# EAGLE design placa2caras_v4 (EAGLE 7.4.0)
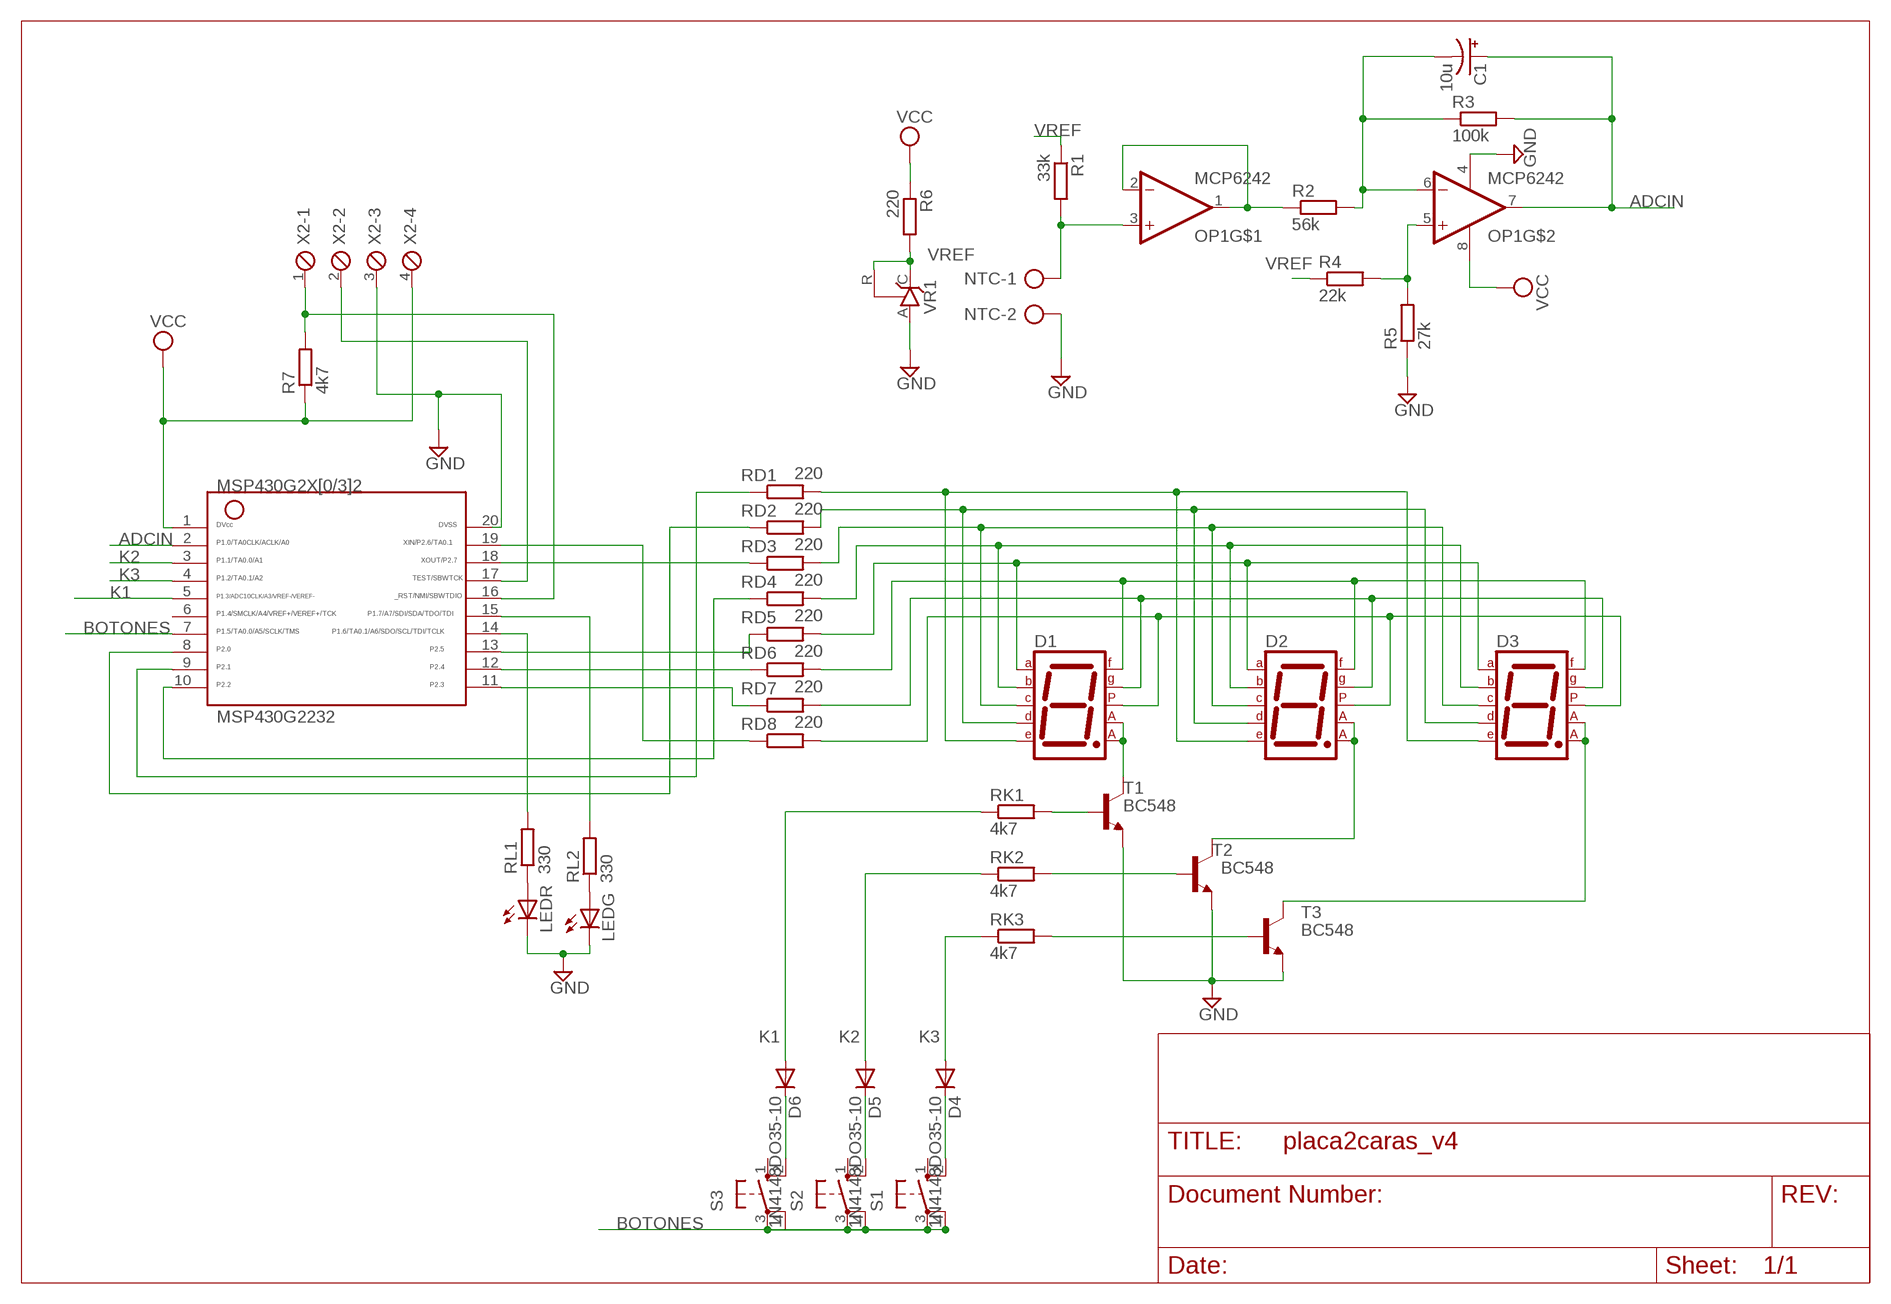
[diagram p0: schematic, sheet 1]

## Parts
C1  10u  CPOL-USE2,5-6E  [E2,5-6E]
D1  7SEG-CA  [7SEG-13]
D2  7SEG-CA  [7SEG-13]
D3  7SEG-CA  [7SEG-13]
D4  1N4148DO35-10  [DO35-10]
D5  1N4148DO35-10  [DO35-10]
D6  1N4148DO35-10  [DO35-10]
LEDG  LED5MM  [LED5MM]
LEDR  LED5MM  [LED5MM]
MSP430G2232  G2X[0/3]2---N20  [N20]
NTC  AK500/2  [AK500/2]
OP1  MCP6242  MCP6242CONPADGORDO  [DIL8_MOD]
R1  33k  R-EU_0207/10  [0207/10]
R2  56k  R-EU_0207/10  [0207/10]
R3  100k  R-EU_0207/10  [0207/10]
R4  22k  R-EU_0207/10  [0207/10]
R5  27k  R-EU_0207/10  [0207/10]
R6  220  R-EU_0207/10  [0207/10]
R7  4k7  R-EU_0207/10  [0207/10]
RD1  220  R-EU_0207/10  [0207/10]
RD2  220  R-EU_0207/10  [0207/10]
RD3  220  R-EU_0207/10  [0207/10]
RD4  220  R-EU_0207/10  [0207/10]
RD5  220  R-EU_0207/10  [0207/10]
RD6  220  R-EU_0207/10  [0207/10]
RD7  220  R-EU_0207/10  [0207/10]
RD8  220  R-EU_0207/10  [0207/10]
RK1  4k7  R-EU_0207/10  [0207/10]
RK2  4k7  R-EU_0207/10  [0207/10]
RK3  4k7  R-EU_0207/10  [0207/10]
RL1  330  R-EU_0207/10  [0207/10]
RL2  330  R-EU_0207/10  [0207/10]
S1  10-XX  [B3F-10XX]
S2  10-XX  [B3F-10XX]
S3  10-XX  [B3F-10XX]
T1  BC548  [TO92-EBC]
T2  BC548  [TO92-EBC]
T3  BC548  [TO92-EBC]
VR1  TL431CLP  [TO92-CLP]
X2  MPT4  [4POL254]

## Nets
ADCIN: C1.+ MSP430G2232.2 OP1.7(OUT) R3.2
BOTONES: MSP430G2232.7 S1.3(P) S1.4(P1) S2.3(P) S2.4(P1) S3.3(P) S3.4(P1)
GND: LEDG.K(C) LEDR.K(C) MSP430G2232.20 NTC.2 OP1.4(V-) R5.1 T1.E T2.E T3.E VR1.A X2.3
K1: D6.A MSP430G2232.5 RK1.1
K2: D5.A MSP430G2232.3 RK2.1
K3: D4.A MSP430G2232.4 RK3.1
N$1: RK1.2 T1.B
N$2: RK2.2 T2.B
N$3: RK3.2 T3.B
N$4: D1.7(A) D2.7(A) D3.7(A) RD5.2
N$5: D1.3(CA1) D1.8(CA2) T1.C
N$6: D1.6(B) D2.6(B) D3.6(B) RD4.2
N$7: D2.3(CA1) D2.8(CA2) T2.C
N$8: D1.4(C) D2.4(C) D3.4(C) RD3.2
N$9: D3.3(CA1) D3.8(CA2) T3.C
N$10: D1.2(D) D2.2(D) D3.2(D) RD2.2
N$11: MSP430G2232.17 X2.2
N$12: D1.1(E) D2.1(E) D3.1(E) RD1.2
N$13: OP1.5(+IN) R4.2 R5.2
N$14: D1.9(F) D2.9(F) D3.9(F) RD6.2
N$15: NTC.1 OP1.3(+IN) R1.2
N$16: D1.10(G) D2.10(G) D3.10(G) RD7.2
N$17: OP1.1(OUT) OP1.2(-IN) R2.1
N$18: D1.5(DP) D2.5(DP) D3.5(DP) RD8.2
N$19: C1.- OP1.6(-IN) R2.2 R3.1
N$20: MSP430G2232.16 R7.2 X2.1
N$21: MSP430G2232.19 RD8.1
N$22: MSP430G2232.18 RD3.1
N$23: MSP430G2232.13 RD5.1
N$24: MSP430G2232.12 RD6.1
N$25: MSP430G2232.11 RD7.1
N$26: MSP430G2232.10 RD4.1
N$27: MSP430G2232.9 RD1.1
N$28: MSP430G2232.8 RD2.1
N$29: D5.C S2.2(S1)
N$30: D4.C S1.2(S1)
N$31: D6.C S3.2(S1)
N$32: MSP430G2232.15 RL2.2
N$33: LEDR.A RL1.1
N$34: MSP430G2232.14 RL1.2
N$35: LEDG.A RL2.1
VCC: MSP430G2232.1 OP1.8(V+) R6.1 R7.1 X2.4
VREF: R1.1 R4.1 R6.2 VR1.C VR1.R
Unconnected: MSP430G2232.6 S1.1(S) S2.1(S) S3.1(S)

## Library data of the parts
C1 = rcl:CPOL-US: POLARIZED CAPACITOR, American symbol
D1-D3 = special:7SEG-CA: 7-segment DISPLAY single anode, 13 mm
D4-D6 = diode:1N4148: DIODE high speed (Philips)
LEDG LEDR = led:LED: LED OSRAM: - CHIPLED LG R971, LG N971, LY N971, LG Q971, LY Q971, LO R971, LY R971 LH N974, LH R974 LS Q976, LO Q976, LY Q976 LO Q996 - Hyper CHIPLED LW Q18S LB Q993, LB Q99A, LB R99A - SideLED LS A670, LO A670, LY A670, LG A670, LP A670 LB A673, LV A673, LT A673, LW A673 LH A674 LY A675 LS A676, LA A676, LO A676, LY A676, LW A676 LS A679, LY A679, LG A679 - Hyper Micro SIDELED® LS Y876, LA Y876, LO Y876, LY Y876 LT Y87S - SmartLED LW L88C, LW L88S LB L89C, LB L89S, LG L890 LS L89K, LO L89K, LY L89K LS L896, LA L896, LO L896, LY L896 - TOPLED LS T670, LO T670, LY T670, LG T670, LP T670 LSG T670, LSP T670, LSY T670, LOP T670, LYG T670 LG T671, LOG T671, LSG T671 LB T673, LV T673, LT T673, LW T673 LH T674 LS T676, LA T676, LO T676, LY T676, LB T676, LH T676, LSB T676, LW T676 LB T67C, LV T67C, LT T67C, LS T67K, LO T67K, LY T67K, LW E67C LS E67B, LA E67B, LO E67B, LY E67B, LB E67C, LV E67C, LT E67C LW T67C LS T679, LY T679, LG T679 LS T770, LO T770, LY T770, LG T770, LP T770 LB T773, LV T773, LT T773, LW T773 LH T774 LS E675, LA E675, LY E675, LS T675 LS T776, LA T776, LO T776, LY T776, LB T776 LHGB T686 LT T68C, LB T68C - Hyper Mini TOPLED® LB M676 - Mini TOPLED Santana® LG M470 LS M47K, LO M47K, LY M47K Source: http://www.osram.convergy.de LUXEON: - LUMILED® LXK2-PW12-R00, LXK2-PW12-S00, LXK2-PW14-U00, LXK2-PW14-V00 LXK2-PM12-R00, LXK2-PM12-S00, LXK2-PM14-U00 LXK2-PE12-Q00, LXK2-PE12-R00, LXK2-PE12-S00, LXK2-PE14-T00, LXK2-PE14-U00 LXK2-PB12-K00, LXK2-PB12-L00, LXK2-PB12-M00, LXK2-PB14-N00, LXK2-PB14-P00, LXK2-PB14-Q00 LXK2-PR12-L00, LXK2-PR12-M00, LXK2-PR14-Q00, LXK2-PR14-R00 LXK2-PD12-Q00, LXK2-PD12-R00, LXK2-PD12-S00 LXK2-PH12-R00, LXK2-PH12-S00 LXK2-PL12-P00, LXK2-PL12-Q00, LXK2-PL12-R00 Source: www.luxeon.com KINGBRIGHT: KA-3528ASYC Source: www.kingbright.com
MSP430G2232 = TI_MSP430_v16:G2X[0/3]2---N20: MSP430G2X[0/3]2 MSP430G2x32, MSP430G2x02 PDIP (N) 20 Pin Package http://focus.ti.com/docs/prod/folders/print/msp430g2432.html
NTC = con-ptr500:AK500/2: CONNECTOR; OC_FARNELL: unknown; OC_NEWARK: unknown
OP1 = linear:MCP6242: Opamp de Microchip. Rail to rail, 3V
R1-R7 RD1-RD8 RK1-RK3 RL1 RL2 = resistor:R-EU_: RESISTOR, European symbol
S1-S3 = switch-omron:10-XX: OMRON SWITCH; MPN: B3F-1000; OC_FARNELL: 176432; OC_NEWARK: 36M3542
T1-T3 = transistor-npn:BC548*: NPN Transistor
VR1 = v-reg:TL431CLP: VOLTAGE REGULATOR
X2 = con-phoenix-254:MPT4: PHOENIX CONNECTOR; OC_FARNELL: unknown; OC_NEWARK: unknown

## Board
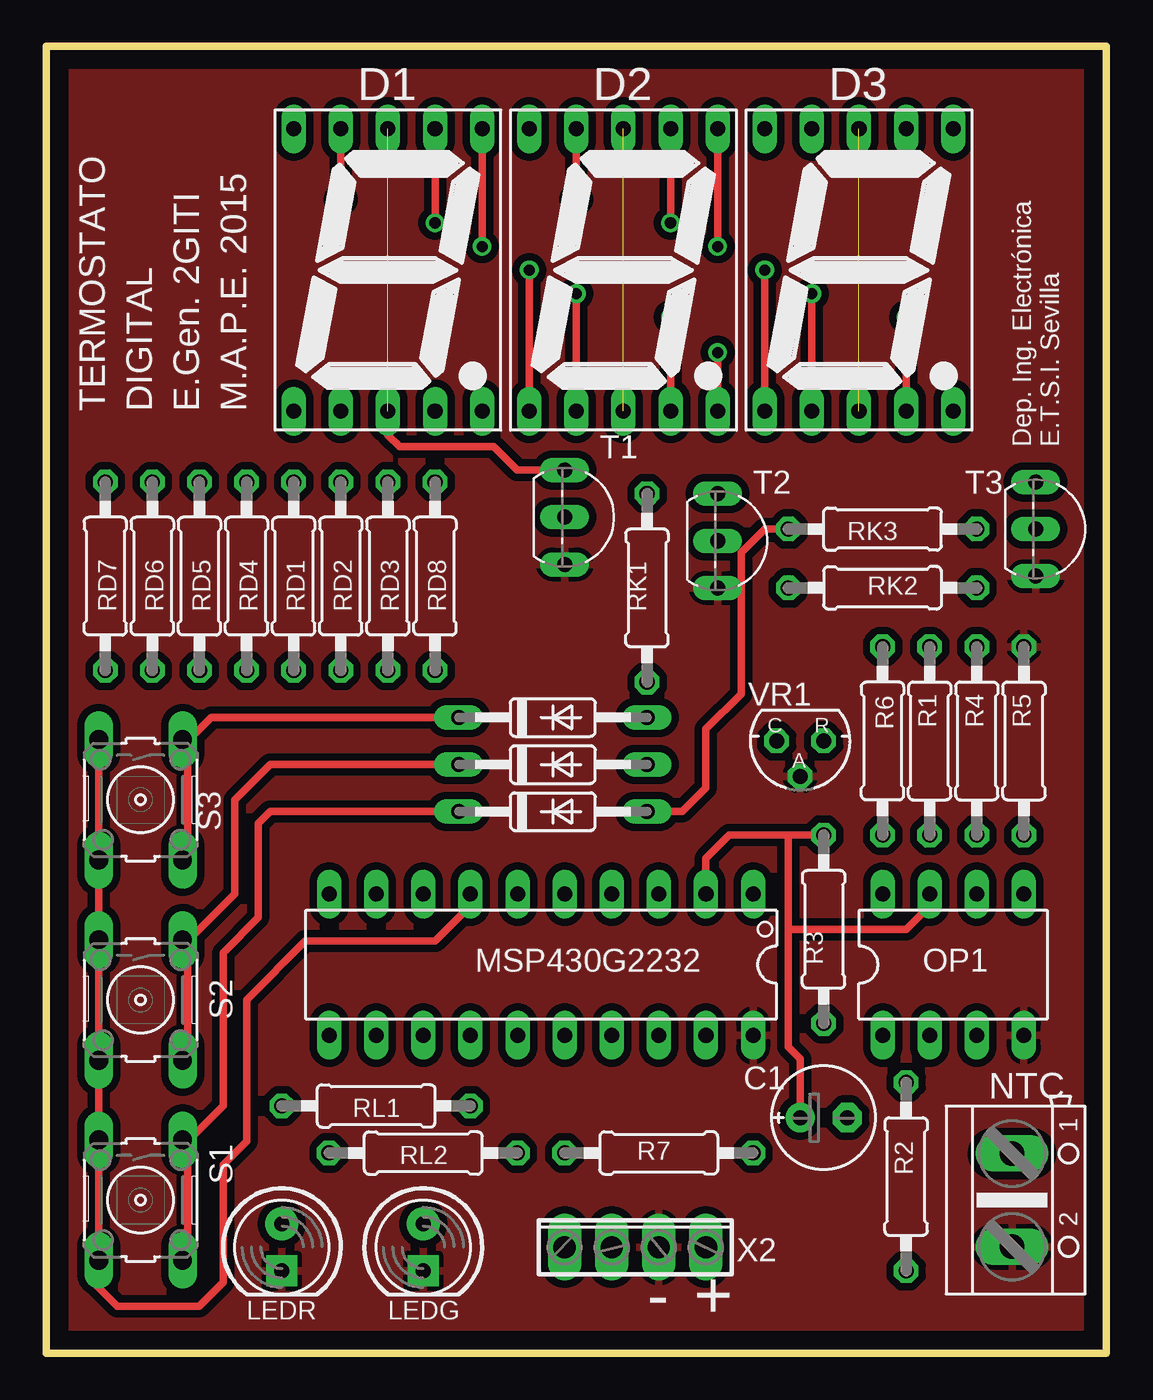
[diagram p1: board, top side]
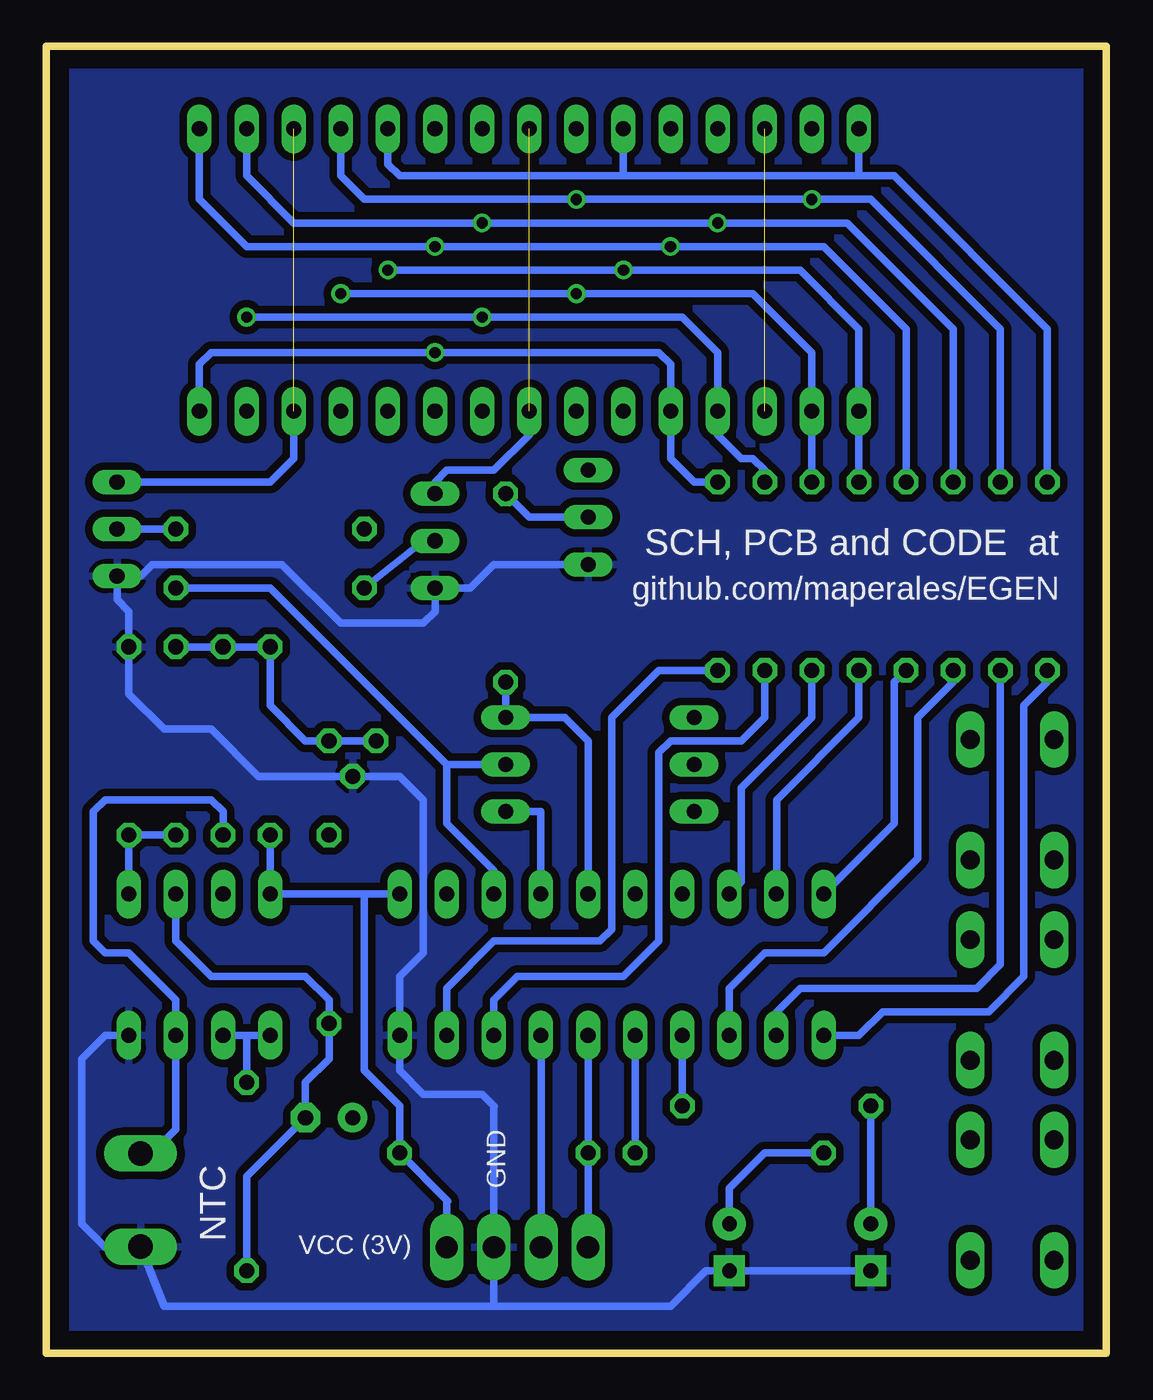
[diagram p2: board, bottom side, seen from below]

Size 57.15 x 70.48 mm. Coordinates in mm from the lower left corner, seen from the top.
Outline: 0,70.48 57.15,70.48 57.15,0 0,0 0,70.48
Copper layers (1*16): Top 0.035mm / dielectric 1.5mm / Bottom 0.035mm
Design rules "default *": minimum track width 10mil, minimum drill 23mil, track to track 8mil, track to pad 8mil, pad to pad 8mil, via to via 8mil, smd to smd 8mil, copper to edge 40mil, drill to drill 8mil, minimum pad ring 10mil, minimum via ring 8mil, stop-mask expansion 4mil, vias tented up to drill 0mil, thermal gap 10mil

### Footprints (pad centres in the part's own frame; a part is rotated, then mirrored left to right if it is on the bottom)
E2,5-6E = drill 0.813 pad 1.575: + -1.27,0 | drill 0.813 pad 1.575 octagon: - 1.27,0
7SEG-13 = drill 0.813 long: 1 -5.08,-7.62; 2 -2.54,-7.62; 3 0,-7.62; 4 2.54,-7.62; 5 5.08,-7.62; 6 5.08,7.62; 7 2.54,7.62; 8 0,7.62; 9 -2.54,7.62; 10 -5.08,7.62
DO35-10 = drill 0.813 long: A 5.08,0; C -5.08,0
LED5MM = drill 0.8 pad 1.778: A -1.27,0 | drill 0.8 pad 1.676 square: K 1.27,0
N20 = drill 0.813 long: 1 -11.435,-3.81; 2 -8.895,-3.81; 3 -6.355,-3.81; 4 -3.815,-3.81; 5 -1.275,-3.81; 6 1.265,-3.81; 7 3.805,-3.81; 8 6.345,-3.81; 9 8.885,-3.81; 10 11.425,-3.81; 11 11.425,3.81; 12 8.885,3.81; 13 6.345,3.81; 14 3.805,3.81; 15 1.265,3.81; 16 -1.275,3.81; 17 -3.815,3.81; 18 -6.355,3.81; 19 -8.895,3.81; 20 -11.435,3.81
AK500/2 = drill 1.321 long: 1 -2.515,0; 2 2.515,0
DIL8_MOD = drill 0.813 pad 1.27 long: 1 -6.35,-3.81; 2 -3.81,-3.81; 3 -1.27,-3.81; 4 1.27,-3.81; 5 1.27,3.81; 6 -1.27,3.81; 7 -3.81,3.81; 8 -6.35,3.81
0207/10 = drill 0.813 octagon: 1 -5.08,0; 2 5.08,0
B3F-10XX = drill 1.016 long: 1 -3.251,2.261; 2 3.251,2.261; 3 -3.251,-2.261; 4 3.251,-2.261
TO92-EBC = drill 0.813 long: B 0,-1.27; C -2.54,-1.27; E 2.54,-1.27
TO92-CLP = drill 0.813 octagon: A 0,1.905; C 1.27,0; R -1.27,0
4POL254 = drill 1.2 long: 1 -3.81,0; 2 -1.27,0; 3 1.27,0; 4 3.81,0

### Placement (x,y rotation side)
C1  41.91,12.7 0 top
D1  18.41,58.42 0 top
D2  31.12,58.42 0 top
D3  43.81,58.42 0 top
D4  27.3,29.21 0 top
D5  27.3,31.75 0 top
D6  27.3,34.29 0 top
LEDG  20.32,5.72 270 top
LEDR  12.7,5.72 270 top
MSP430G2232  26.67,20.95 180 top
NTC  52.07,8.25 270 top
OP1  51.44,20.95 0 top
R1  47.62,33.02 270 top
R2  46.35,9.52 270 top
R3  41.91,22.86 90 top
R4  50.16,33.02 270 top
R5  52.7,33.02 270 top
R6  45.09,33.02 90 top
R7  33.02,10.8 180 top
RD1  13.34,41.91 90 top
RD2  15.88,41.91 90 top
RD3  18.41,41.91 90 top
RD4  10.79,41.91 90 top
RD5  8.25,41.91 90 top
RD6  5.71,41.91 90 top
RD7  3.17,41.91 90 top
RD8  20.95,41.91 90 top
RK1  32.38,41.28 90 top
RK2  45.09,41.28 180 top
RK3  45.09,44.45 0 top
RL1  17.78,13.34 0 top
RL2  20.32,10.8 0 top
S1  5.08,8.25 270 top
S2  5.08,19.05 270 top
S3  5.08,29.85 270 top
T1  29.21,45.09 270 top
T2  37.46,43.82 270 top
T3  54.61,44.45 270 top
VR1  40.64,33.02 180 top
X2  31.75,5.72 0 top

### Tracks (layer width: path | path; a pad name or v marks a point on that pad's centre or on a via)
ADCIN
  Top 0.406: MSP430G2232.2 35.56,26.68 36.83,27.94 40.01,27.94 | 40.01,22.86 40.01,16.51 40.64,15.88 C1.+ | 40.01,22.86 40.01,27.94 | OP1.7 47.62,24.13 46.35,22.86 40.01,22.86 | R3.2 40.01,27.94
BOTONES
  Top 0.406: S3.3 S3.4 S2.3 S2.4 S1.3 S1.4 2.54,4.72 2.54,3.81 3.81,2.54 8.25,2.54 9.53,3.81 9.53,10.16 10.79,11.43 10.79,19.05 13.97,22.22 20.95,22.22 22.86,24.13 MSP430G2232.7
GND
  Bottom 0.406: LEDR.K LEDG.K 21.59,4.45 23.5,2.54 33.02,2.54 | 33.02,2.54 X2.3 33.02,13.29 33,13.31 33.66,13.97 36.83,13.97 38.1,15.24 MSP430G2232.20 38.1,20.32 36.83,21.59 36.83,29.85 38.1,31.11 VR1.A 45.72,31.11 48.26,33.66 50.8,33.66 52.7,35.56 R5.1 52.7,40.01 53.34,40.64 T3.E 52.07,41.91 51.44,42.55 44.45,42.55 41.27,39.37 36.83,39.37 36.2,40.01 T2.E 34.29,41.28 33.02,42.55 T1.E | 33.02,2.54 50.8,2.54 52.07,5.72 NTC.2 52.09,5.72 53.98,5.72 55.24,6.99 55.24,15.88 53.98,17.14 OP1.4
  pour Bottom (isolate 0.406): 0.63,69.85 56.52,69.85 56.52,1.27 0.63,1.27
  pour Top (isolate 0.406): 0.63,69.85 56.52,69.85 56.52,1.27 0.63,1.27
K1
  Bottom 0.406: MSP430G2232.5 27.95,33.03 29.21,34.29 D6.A RK1.1
K2
  Bottom 0.406: MSP430G2232.3 33.02,26.04 35.56,28.57 35.56,31.75 | 35.56,31.75 D5.A | RK2.1 45.09,41.28 35.56,31.75
K3
  Top 0.406: RK3.1 38.73,44.45 37.46,43.18 37.46,35.56 35.56,33.66 35.56,30.48 34.29,29.21 D4.A
  Bottom 0.406: MSP430G2232.4 30.48,29.21 D4.A
N$1
  Bottom 0.406: T1.B 31.12,45.09 RK1.2
N$2
  Bottom 0.406: RK2.2 36.83,43.82 T2.B
N$3
  Bottom 0.406: RK3.2 T3.B
N$4  (via drill 0.6)
  Top 0.406: D1.7 v20.95,60.96 | D2.7 v33.66,60.96
  Bottom 0.406: D3.7 46.35,63.5 43.81,60.96 v33.66,60.96 v20.95,60.96 13.97,60.96 8.25,55.25 RD5.2
N$5  (1 unrouted)
  Top 0.406: D1.3 18.41,49.53 19.05,48.9 24.13,48.9 25.4,47.62 T1.C
N$6  (via drill 0.6)
  Top 0.406: D1.6 v23.5,59.69 | D2.6 v36.2,59.69
  Bottom 0.406: D3.6 48.9,62.23 46.35,59.69 v36.2,59.69 v23.5,59.69 15.24,59.69 10.79,55.25 RD4.2
N$7  (1 unrouted)
  Bottom 0.406: T2.C 36.2,46.99 35.56,47.62 33.02,47.62 31.12,49.53 D2.3
N$8  (via drill 0.6)
  Top 0.406: D2.4 v33.66,55.88 | D3.4 v46.35,55.88
  Bottom 0.406: v46.35,55.88 v33.66,55.88 22.86,55.88 20.95,53.98 D1.4 20.95,49.53 19.68,48.26 19.05,48.26 18.41,47.62 RD3.2
N$9  (1 unrouted)
  Bottom 0.406: T3.C 45.09,46.99 43.81,48.26 D3.3
N$10  (via drill 0.6)
  Top 0.406: D2.2 v28.58,57.15 | D3.2 v41.27,57.15
  Bottom 0.406: v41.27,57.15 v28.58,57.15 19.05,57.15 15.88,53.98 D1.2 RD2.2
N$11
  Bottom 0.406: 30.5,17.13 MSP430G2232.17 X2.2
N$12  (via drill 0.6)
  Top 0.406: D2.1 v26.04,58.42 | D3.1 v38.73,58.42
  Bottom 0.406: v38.73,58.42 v26.04,58.42 16.51,58.42 13.34,55.25 D1.1 RD1.2
N$13
  Bottom 0.406: OP1.5 R5.2 R4.2
N$14  (via drill 0.6)
  Top 0.406: D1.9 v15.88,62.23 | D2.9 v28.58,62.23
  Bottom 0.406: D3.9 41.27,63.5 40.01,62.23 v28.58,62.23 v15.88,62.23 12.7,62.23 5.71,55.25 RD6.2
N$15
  Bottom 0.406: R1.2 47.62,29.21 48.26,29.85 53.98,29.85 54.61,29.21 54.61,22.22 53.98,21.59 52.7,21.59 50.16,19.05 OP1.3 50.16,12.07 51.44,10.8 52.05,10.8 NTC.1
N$16
  Bottom 0.406: 13.34,63.5 11.43,63.5 3.17,55.25 RD7.2 | D1.10 13.34,63.5 | 13.34,63.5 26.04,63.5 | 26.04,63.5 D2.10 | D3.10 38.73,64.14 38.1,63.5 26.04,63.5
N$17
  Bottom 0.406: OP1.2 46.35,17.14 | 46.35,17.14 OP1.1 | R2.1 46.35,17.14
N$18  (via drill 0.6)
  Top 0.406: D2.5 v36.2,53.98
  Bottom 0.406: D3.5 48.9,53.34 48.26,53.98 v36.2,53.98 24.13,53.98 23.5,53.34 D1.5 23.5,48.26 22.23,46.99 RD8.2
N$19
  Bottom 0.406: OP1.6 50.16,22.22 48.26,20.32 43.18,20.32 41.91,19.05 R3.1 41.91,15.88 43.18,14.61 C1.- 46.35,9.52 R2.2
N$20
  Bottom 0.406: MSP430G2232.16 27.95,11.43 R7.2 X2.1
N$21
  Bottom 0.406: MSP430G2232.19 35.56,19.68 33.02,22.22 27.3,22.22 26.67,22.86 26.67,34.29 24.13,36.83 RD8.1
N$22
  Bottom 0.406: MSP430G2232.18 33.02,19.05 31.75,20.32 26.04,20.32 24.13,22.22 24.13,32.39 23.5,33.02 19.68,33.02 18.41,34.29 RD3.1
N$23
  Bottom 0.406: MSP430G2232.13 20.32,19.68 18.41,21.59 15.24,21.59 10.16,26.67 10.16,34.29 8.25,36.2 RD5.1
N$24
  Bottom 0.406: RD6.1 5.71,20.95 6.98,19.68 16.51,19.68 17.78,18.41 MSP430G2232.12
N$25
  Bottom 0.406: RD7.1 3.17,36.2 4.45,34.93 4.45,20.32 6.35,18.41 12.07,18.41 13.34,17.14 MSP430G2232.11
N$26
  Bottom 0.406: MSP430G2232.10 11.43,28.58 11.43,36.2 RD4.1
N$27
  Bottom 0.406: RD1.1 13.34,34.29 17.78,29.85 MSP430G2232.9
N$28
  Bottom 0.406: RD2.1 15.88,34.29 19.68,30.48 19.68,25.4 MSP430G2232.8
N$29
  Top 0.406: D5.C 12.07,31.75 10.16,29.85 10.16,24.77 7.62,22.22 7.62,16.08 S2.2
N$30
  Top 0.406: D4.C 12.07,29.21 11.43,28.57 11.43,23.5 9.53,21.59 9.53,13.34 7.62,11.43 7.62,5.28 S1.2
N$31
  Top 0.406: D6.C 8.89,34.29 7.62,33.02 7.62,26.87 S3.2
N$32
  Bottom 0.406: RL2.2 MSP430G2232.15
N$33
  Bottom 0.406: LEDR.A RL1.1
N$34
  Bottom 0.406: MSP430G2232.14 22.86,13.97 RL1.2
N$35
  Bottom 0.406: RL2.1 18.41,10.8 20.32,8.89 LEDG.A
VCC
  Bottom 0.406: 40.01,24.77 OP1.8 R6.1 | 40.01,24.77 MSP430G2232.1 | 40.01,24.77 40.01,15.24 38.1,13.34 R7.1 35.5,8.2 35.56,8.14 X2.4
VREF
  Bottom 0.406: VR1.C VR1.R 43.18,33.02 45.09,34.93 R6.2 R1.1 R4.1

### Text on the board
tNames: TERMOSTATO | DIGITAL | E.Gen. 2GITI | M.A.P.E. 2015 | Dep. Ing. Electrónica / E.T.S.I. Sevilla | - | +
bNames: SCH, PCB and CODE at | github.com/maperales/EGEN | NTC | GND | VCC (3V)